# Altium project uMultimeter_ExpProbeB.PrjPCB
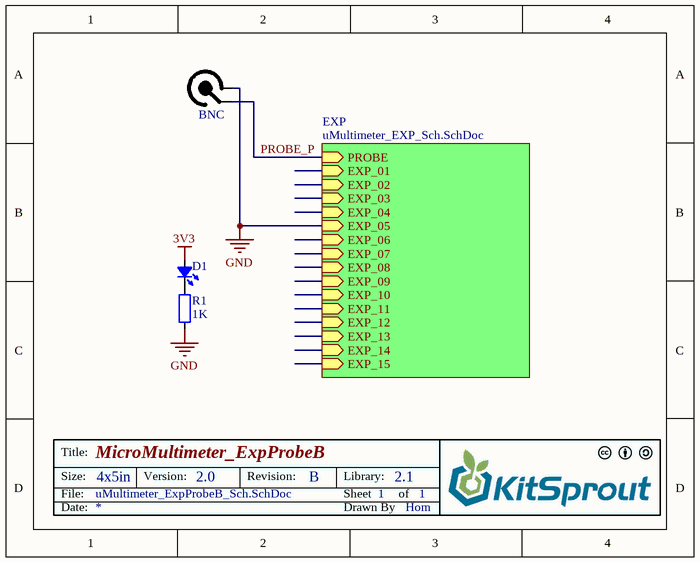
[diagram p0: uMultimeter_ExpProbeB_Sch.SchDoc]
2 sheets, 4 parts. Net scope: hierarchical (ports join the sheet entries above them; power ports are global).
Board file: uMultimeter_ExpProbeB_Pcb.PcbDoc
Sheets:
  uMultimeter_ExpProbeB_Sch.SchDoc
    EXP = uMultimeter_EXP_Sch.SchDoc

## Sheet uMultimeter_ExpProbeB_Sch.SchDoc: MicroMultimeter_ExpProbeB
size 127 x 101 mm; Author: Hom; CompanyName: KitSprout; DrawnBy: Hom; Engineer: Hom; Organization: KitSprout; Revision: B; SheetNumber: 1; SheetTotal: 1; License: CC BY-SA 4.0; Version: 2.0; LibVersion: 2.1; PageSetup: Record=PageOptions|CenterHorizontal=True|CenterVertical=True|PrintScale=1.00|XCorrection=1.00|YCorrection=1.00|PrintKind=0|BorderSize=5000000|LeftOffset=0|BottomOffset=0|Orientation=2|PaperLength=1000|PaperWidth=1000|Scale=100|PaperSource=7|PrintQuality=-3|MediaType=1|DitherType=10|PrintScaleMode=0|PaperKind=A4|PaperIndex=9

### Parts
BNC  BNC  [BNC_4P]  (value not drawn)
D1  LED_0805  [LED_0805_BLUE]  (value not drawn)
R1  value 1K  [RES_0603]  (hidden comment: Res_0603)

### Sub-sheets
EXP = uMultimeter_EXP_Sch.SchDoc: PROBE (in), EXP_01 (in), EXP_02 (in), EXP_03 (in), EXP_04 (in), EXP_05 (in), EXP_06 (in), EXP_07 (in), EXP_08 (in), EXP_09 (in), EXP_10 (in), EXP_11 (in), EXP_12 (in), EXP_13 (in), EXP_14 (in), EXP_15 (in)

### Nets
3V3: D1.1(A)
GND: BNC.2 R1.2 ; sheet EXP/EXP_05
PROBE_P: BNC.1 ; sheet EXP/PROBE
NetD1_2: D1.2(K) R1.1

### Notes on the sheet
- Title:
- Size:
- Date:
- File:
- 4x5in
- Version:
- Revision:
- Sheet
- Drawn By
- Library:
- of

### Library data of the parts
D1 = LED_0805: LED
R1 = Res_0603: Resistor

## Sheet uMultimeter_EXP_Sch.SchDoc: MicroMultimeter - EXP
size 127 x 101 mm; Author: Hom; CompanyName: KitSprout; DrawnBy: Hom; Engineer: Hom; Organization: KitSprout; Revision: A; SheetNumber: 1; SheetTotal: 1; License: CC BY-SA 4.0; Version: 2.0; LibVersion: 2.0; PageSetup: Record=PageOptions|CenterHorizontal=True|CenterVertical=True|PrintScale=1.00|XCorrection=1.00|YCorrection=1.00|PrintKind=0|BorderSize=5000000|LeftOffset=0|BottomOffset=0|Orientation=2|PaperLength=1000|PaperWidth=1000|Scale=100|PaperSource=7|PrintQuality=-3|MediaType=1|DitherType=10|PrintScaleMode=0|PaperKind=A4|PaperIndex=9
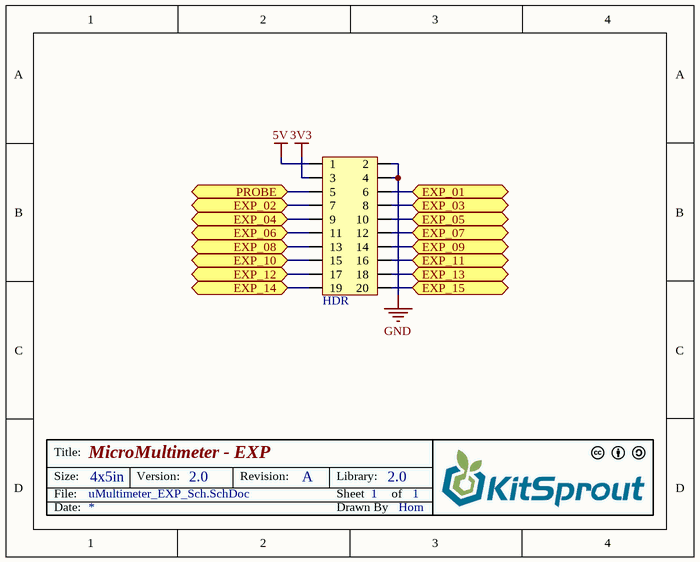
[diagram p1: uMultimeter_EXP_Sch.SchDoc]

### Parts
HDR  HDR2x10_2.54  [HDR2X10_2.54_180H]  (value not drawn)

### Ports
EXP_01, EXP_02, EXP_03, EXP_04, EXP_05, EXP_06, EXP_07, EXP_08, EXP_09, EXP_10, EXP_11, EXP_12, EXP_13, EXP_14, EXP_15, PROBE

### Nets
3V3: HDR.3
5V: HDR.1
GND: HDR.2 HDR.4 HDR.10 ; port EXP_05
PROBE_P: HDR.5 ; port PROBE
NetHDR_6: HDR.6 ; port EXP_01
NetHDR_7: HDR.7 ; port EXP_02
NetHDR_8: HDR.8 ; port EXP_03
NetHDR_9: HDR.9 ; port EXP_04
NetHDR_11: HDR.11 ; port EXP_06
NetHDR_12: HDR.12 ; port EXP_07
NetHDR_13: HDR.13 ; port EXP_08
NetHDR_14: HDR.14 ; port EXP_09
NetHDR_15: HDR.15 ; port EXP_10
NetHDR_16: HDR.16 ; port EXP_11
NetHDR_17: HDR.17 ; port EXP_12
NetHDR_18: HDR.18 ; port EXP_13
NetHDR_19: HDR.19 ; port EXP_14
NetHDR_20: HDR.20 ; port EXP_15

### Notes on the sheet
- Title:
- Size:
- Date:
- File:
- 4x5in
- Version:
- Revision:
- Sheet
- Drawn By
- Library:
- of

### Library data of the parts
HDR = HDR2x10_2.54: Header

## Nets that join several sheets
3V3: uMultimeter_ExpProbeB_Sch (D1.1), uMultimeter_EXP_Sch (HDR.3)
GND: uMultimeter_ExpProbeB_Sch (BNC.2 R1.2), uMultimeter_EXP_Sch (HDR.2 HDR.4 HDR.10)
PROBE_P: uMultimeter_ExpProbeB_Sch (BNC.1), uMultimeter_EXP_Sch (HDR.5)